# Altium schematic sheet Peripheral.SchDoc
size 381 x 215 mm; SheetNumber: 2; SheetTotal: 2
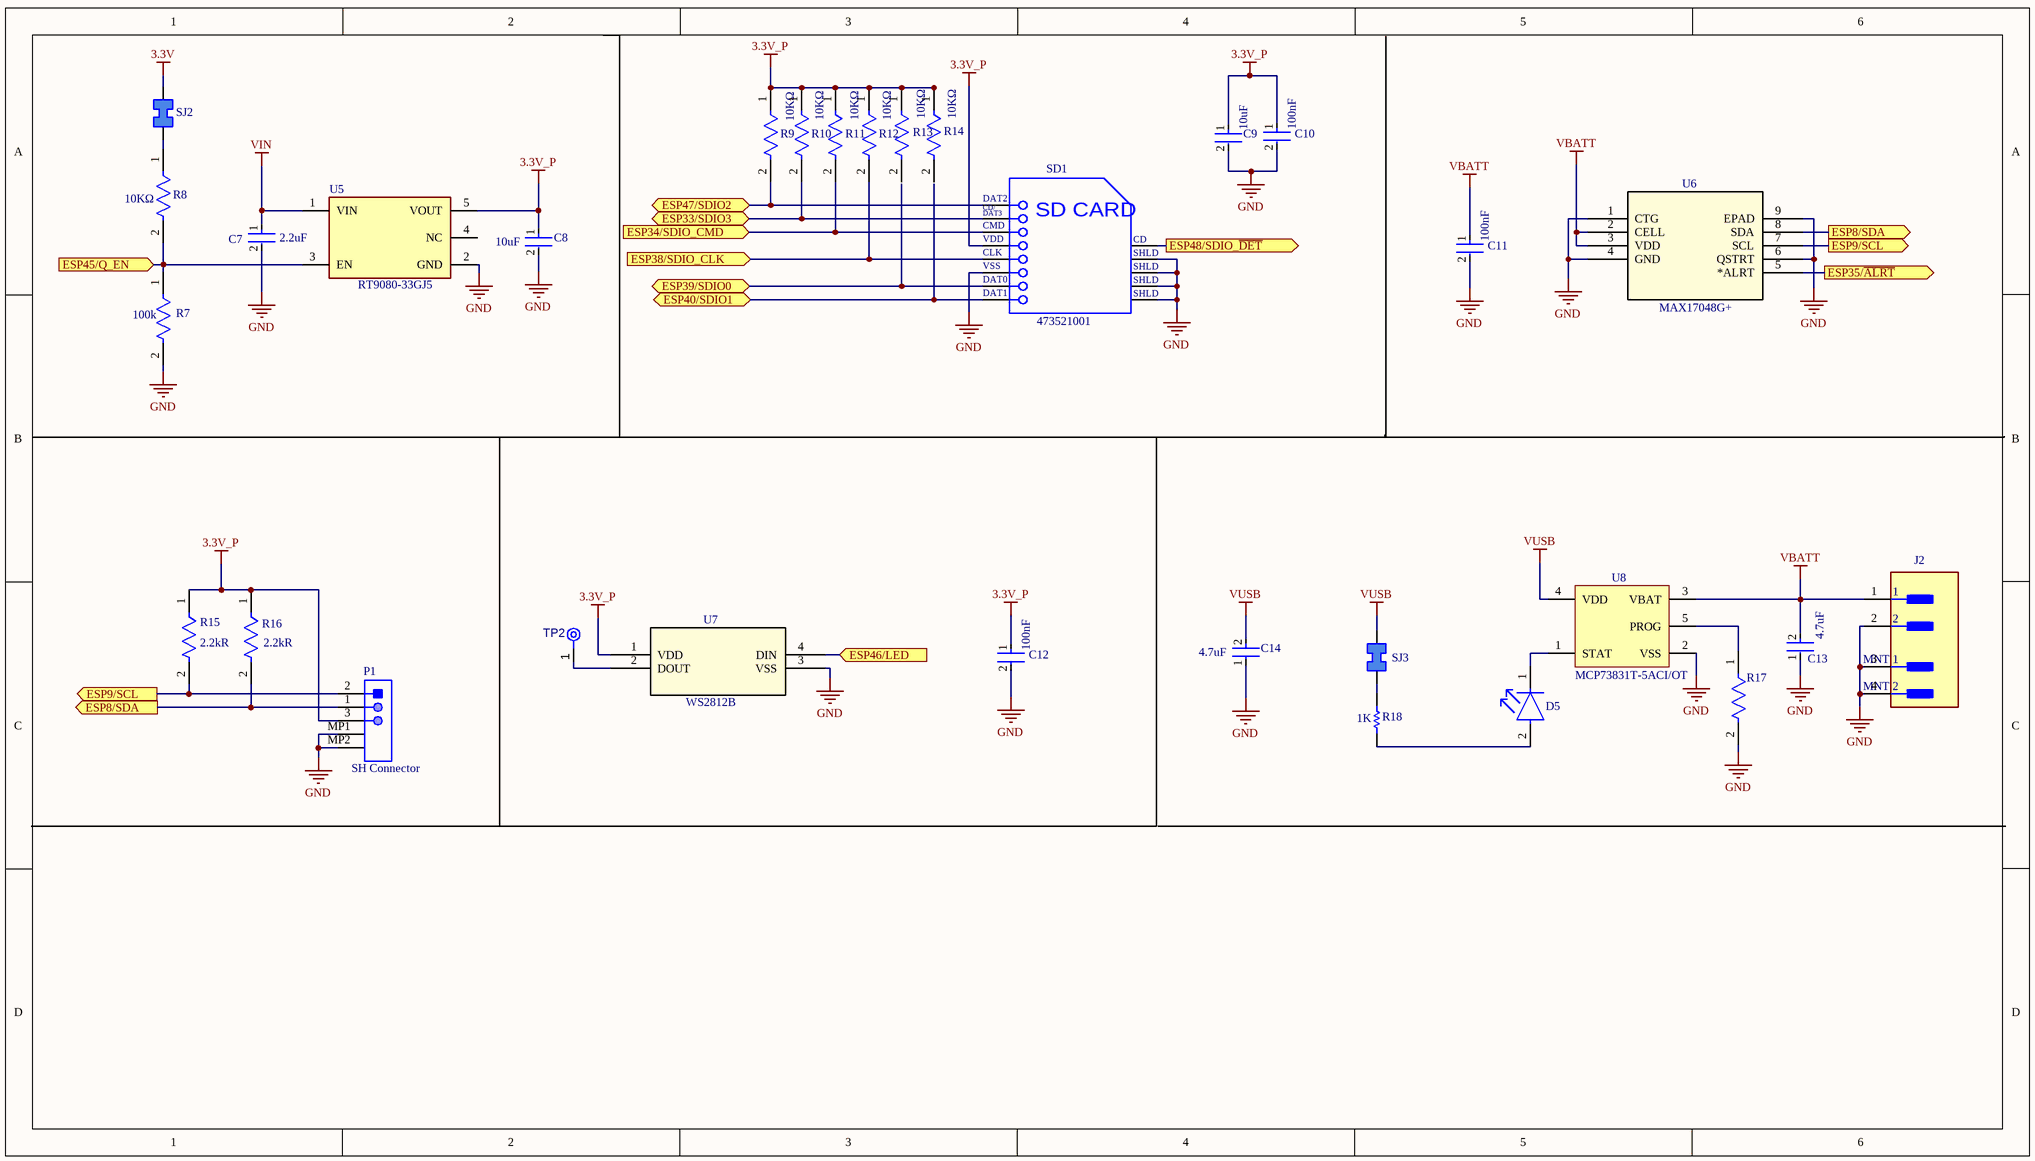
[diagram p0: Peripheral.SchDoc]

## Parts
C7  Capacitance: 2.2uF  [FP-GRM155-0_1-IPC_C]  (hidden comment: GRM155C81A225KE44D)
C8  Capacitance: 10uF  [FP-CL21-IPC_C]  (hidden comment: CL21A106MQFNNNE)
C9  Capacitance: 10uF  [FP-CL21-IPC_C]  (hidden comment: CL21A106MQFNNNE)
C10  Capacitance: 100nF  [FP-GRM033-0_03-IPC_B]  (hidden comment: GRM033C70J104KE14D)
C11  Capacitance: 100nF  [FP-GRM033-0_03-IPC_B]  (hidden comment: GRM033C70J104KE14D)
C12  Capacitance: 100nF  [FP-GRM033-0_03-IPC_B]  (hidden comment: GRM033C70J104KE14D)
C13  Capacitance: 4.7uF  [FP-0402-L_1_0_0_15-W_0_5-IPC_C]  (hidden comment: JMK105BC6475MV-F)
C14  Capacitance: 4.7uF  [FP-GRM219-0_15-0_1-IPC_C]  (hidden comment: GRM219R6YA475MA73D)
D5  LTST-C191KSKT  [FP-LTST-C191KSKT-MFG]  (value not drawn)
J2  SM02B-SRSS-TB (LF)(SN)  [FP-SM02B-SRSS-TB_LF_SN-MFG]  (value not drawn)
P1  SH Connector  [JST-SM03B-SRSS-TB_V]
R7  Resistance: 100k  [FP-CRCW0402-C-e3-MFG]  (hidden comment: CRCW0402100KFKEDC)
R8  value 10KΩ  [FP-RT0201-MFG]  (hidden comment: RT0201FRE0710KL)
R9  value 10KΩ  [FP-RT0201-MFG]  (hidden comment: RT0201FRE0710KL)
R10  value 10KΩ  [FP-RT0201-MFG]  (hidden comment: RT0201FRE0710KL)
R11  value 10KΩ  [FP-RT0201-MFG]  (hidden comment: RT0201FRE0710KL)
R12  value 10KΩ  [FP-RT0201-MFG]  (hidden comment: RT0201FRE0710KL)
R13  value 10KΩ  [FP-RT0201-MFG]  (hidden comment: RT0201FRE0710KL)
R14  value 10KΩ  [FP-RT0201-MFG]  (hidden comment: RT0201FRE0710KL)
R15  Resistance: 2.2kR  [FP-CRCW0402-e3-IPC_B]  (hidden comment: CRCW04022K20FKEDC)
R16  Resistance: 2.2kR  [FP-CRCW0402-e3-IPC_B]  (hidden comment: CRCW04022K20FKEDC)
R17  CR0402AFX-2001GLF  [FP-CR0402A-IPC_A]  (value not drawn)
R18  Resistance: 1K  [RESC1005X40X25ML10T10]  (hidden comment: 1-1622826-8)
SD1  473521001  [MOLX-473521001_V]
SJ2  Solder Jumper  [Solder Jumper-Footprint-1]  (value not drawn)
SJ3  Solder Jumper  [Solder Jumper-Footprint-1]  (value not drawn)
TP2  TPAD6R  [TP06R]  (value not drawn)  (no BOM)
U5  RT9080-33GJ5  [FP-RT9080-33GJ5-IPC_C]
U6  MAX17048G+  [21-0168_T822+3_MXM]
U7  WS2812B  [WS2812B_WDS]
U8  MCP73831T-5ACI/OT  [SOT-23-OT5_N]

## Ports
ESP8/SDA (out, see Esp32_USB[3B], Esp32_USB[6C], Peripheral[1C]), ESP8/SDA (out, see Esp32_USB[3B], Esp32_USB[6C], Peripheral[6A]), ESP9/SCL (out, see Esp32_USB[3B], Esp32_USB[6C], Peripheral[1C]), ESP9/SCL (out, see Esp32_USB[3B], Esp32_USB[6C], Peripheral[6A]), ESP33/SDIO3 (bidir, see Esp32_USB[4A]), ESP34/SDIO_CMD (in, see Esp32_USB[4A]), ESP35/~{ALRT} (out, see Esp32_USB[4A]), ESP38/SDIO_CLK (in, see Esp32_USB[4B]), ESP39/SDIO0 (bidir, see Esp32_USB[4B]), ESP40/SDIO1 (bidir, see Esp32_USB[4B]), ESP45/Q_EN (in, see Esp32_USB[4B]), ESP46/LED (in, see Esp32_USB[4B]), ESP47/SDIO2 (bidir, see Esp32_USB[4B]), ESP48/SDIO_~{DET} (out, see Esp32_USB[4B])

## Nets
3.3V: SJ2.1
3.3V_P: C8.1 C9.1 C10.1 C12.1 P1.3 R9.1 R10.1 R11.1 R12.1 R13.1 R14.1 R15.1 R16.1 SD1.4(VDD) U5.5(VOUT) U7.1(VDD)
GND: C7.2 C8.2 C9.2 C10.2 C11.2 C12.2 C13.1 C14.1 J2.2 J2.3(MNT_1) J2.4(MNT_2) P1.MP1 P1.MP2 R7.2 R17.2 SD1.6(VSS) SD1.10(SHLD) SD1.11(SHLD) SD1.12(SHLD) SD1.13(SHLD) U5.2(GND) U6.1(CTG) U6.4(GND) U6.6(QSTRT) U6.9(EPAD) U7.3(VSS) U8.2(VSS)
VBATT: C11.1 C13.2 J2.1 U6.2(CELL) U6.3(VDD) U8.3(VBAT)
VIN: C7.1 U5.1(VIN)
VUSB: C14.2 SJ3.1 U8.4(VDD)
ESP8/SDA: P1.1 R16.2 U6.8(SDA) ; port ESP8/SDA
ESP9/SCL: P1.2 R15.2 U6.7(SCL) ; port ESP9/SCL
ESP33/SDIO3: R10.2 SD1.2(CD/DAT3) ; port ESP33/SDIO3
ESP34/SDIO_CMD: R11.2 SD1.3(CMD) ; port ESP34/SDIO_CMD
ESP35/~{ALRT}: U6.5(*ALRT) ; port ESP35/~{ALRT}
ESP38/SDIO_CLK: R12.2 SD1.5(CLK) ; port ESP38/SDIO_CLK
ESP39/SDIO0: SD1.7(DAT0) ; port ESP39/SDIO0
ESP40/SDIO1: SD1.8(DAT1) ; port ESP40/SDIO1
ESP45/Q_EN: R7.1 R8.2 U5.3(EN) ; port ESP45/Q_EN
ESP46/LED: U7.4(DIN) ; port ESP46/LED
ESP47/SDIO2: R9.2 SD1.1(DAT2) ; port ESP47/SDIO2
ESP48/SDIO_~{DET}: SD1.9(CD) ; port ESP48/SDIO_~{DET}
NetD5_1: D5.1(C) U8.1(STAT)
NetD5_2: D5.2(A) R18.2
NetR8_1: R8.1 SJ2.2
NetR17_1: R17.1 U8.5(PROG)
NetR18_1: R18.1 SJ3.2
NetTP2_1: TP2.1(TP) U7.2(DOUT)

Not connected (* = marked no-connect by the designer): R13 2; R14 2; U5 4(NC)

## Notes on the sheet
- (in symbol CMP-2000-05848-1) CD/; DAT3; SD CARD

## Library data of the parts
C7 = CMP-06035-004415-1: Chip Multilayer Ceramic Capacitors for General Purpose, 0402, 2.2uF, X6S, 22%, 10%, 10V; Max Operating Temperature: 105°C; Case Code (Imperial): 0402; Mount: Surface Mount; Case/Package: 0402; Termination: SMD/SMT; Voltage Rating: 10V; Tolerance: 10%; Thickness: 0.022inch; Length: 0.039inch; Packaging: Tape and Reel; Weight: 0.000212oz; Width: 0.02inch; Dielectric: X6S; Package Quantity: 10000; Min Operating Temperature: -55°C; Height: 0.5mm; Case Code (Metric): 1005; Voltage Rating (DC): 10V
C8 C9 = CMP-13271-000780-1: CL21 Series 0805 10uF 6.3V ±20% Tolerance X5R Multilayer Ceramic Chip Capacitor; Thickness: 0.053inch; Voltage Rating: 6.3V; Case Code (Metric): 2012; Width: 0.049inch; Radiation Hardening: No; Height: 1.25mm; Voltage Rating (DC): 6.3V; Depth: 1.25mm; Tolerance: 20%; Lead Free: Lead Free; Case Code (Imperial): 0805; Max Operating Temperature: 85°C; Length: 2mm; Packaging: Tape and Reel; Mount: Surface Mount; Dielectric: X5R; Case/Package: 0805; Min Operating Temperature: -55°C
C10-C12 = CMP-06035-000516-1: Chip Multilayer Ceramic Capacitors for General Purpose, 0201, 0.10uF, X7S, 22%, 10%, 6.3V; Dielectric: X7S; Thickness: 300um; Length: 600um; Voltage Rating (DC): 6.3V; Width: 300um; Tolerance: 10%
C13 = CMP-14477-001053-2: None; Voltage Rating: 6.3V; Tolerance: 20%; Case/Package: 0402; Packaging: Tape and Reel; Min Operating Temperature: -55°C; Max Operating Temperature: 105°C; Case Code (Metric): 1005; RoHS Compliant: Yes; Lead Free: Lead Free; Mount: Surface Mount; Case Code (Imperial): 0402
C14 = CMP-2007-00095-2: Chip Multilayer Ceramic Capacitors for General Purpose, 0805, 4.7uF, X5R, 15%, 20%, 35V; Case Code (Metric): 2012; Case Code (Imperial): 0805; Voltage Rating (DC): 35V; Case/Package: 0805; Voltage Rating: 35V; Depth: 1.25mm; Thickness: 0.037inch; Height: 0.85mm; Lead Free: Lead Free; Package Quantity: 4000; Length: 2mm; Width: 1.25mm; Mount: Surface Mount; Voltage: 35V; Packaging: Tape and Reel; Min Operating Temperature: -55°C; Termination: SMD/SMT; Tolerance: 20%; Dielectric: X5R; REACH SVHC: No SVHC; Max Operating Temperature: 85°C
D5 = CMP-22017-000025-1: LED YELLOW CLEAR SMD; Dominant Wavelength: 597nm; Power Rating: 75mW; Number of LEDs: 1; Lens Style: Diffused; Forward Current: 30mA; Test Current: 20mA; Forward Voltage: 2.4V; Wavelength: 588nm; Viewing Angle: 130°; Lens Color: Colorless; Reverse Voltage: 5V; Luminous Intensity: 180mcd; Case Code (Imperial): 0603; Width: 0.8mm; Power Dissipation: 75mW; Length: 1.6mm; Illumination Color: Yellow; Number of Pins: 2; Case Code (Metric): 1608; Mount: Surface Mount; Number of Elements: 1; Height: 0.55mm; Lens Transparency: Clear; Depth: 0.8mm; Min Operating Temperature: -55°C; Case/Package: 0603; Radiation Hardening: No; Max Operating Temperature: 85°C; Package Quantity: 1; Packaging: Tape and Reel; Lead Free: Lead Free; Color: Yellow
J2 = CMP-17439-000368-1: CONN HEADER SMD R/A 2POS 1MM; Max Current Rating: 1A; Voltage Rating (AC): 50V; Current Rating: 700mA; Contact Resistance: 40mR; Number of Positions: 2; Insulation Resistance: 100MR; Fastening Type: Pull; Orientation: Right Angle; Insulation Color: Natural; Insulation Material: Nylon; Connector Type: Header; Contact Type: Male Pin; Number of Rows: 1; Housing Material: Polyamide; Contact Material: Copper Alloy; Mount: Surface Mount; Packaging: Tape and Reel; Lead Pitch: 1mm; REACH SVHC: No SVHC; Flammability Rating: UL94 V-0; Termination: Solder; Series: SR; Length: 4mm; Color: Natural; Min Operating Temperature: -25°C; Pitch: 1mm; Depth: 4.95mm; Contact Plating: Tin; Lead Free: Lead Free; Max Operating Temperature: 85°C; Contact Finish - Mating: TIN; Material: Polyamide; Voltage Rating: 50V; Max Voltage Rating (AC): 50V; Housing Color: Beige; Contact Shape: Square; Number of Contacts: 2
P1 = CMP-2000-07077-1: Male Header, Pitch 1 mm, 1 x 3 Position, Height 2.9 mm, -25 to 85 degC, RoHS, Tape and Reel; Manufacturer: JST; Pitch: 1mm; Style/Orientation: RightAngleHeader/Plug; No of Positions: 3; Package Description: Male Header, Pitch 1 mm, 1 x 3 Position, Height 2.9 mm; Manufacturer URL: http://www.jst.com/home2.html; Package Reference: SM03B-SRSS-TB; Type: ShroudedHeader; Termination: Crimp; Mounting Technology: SurfaceMount; Datasheet Version: 11/2010; Datasheet URL: https://datasheet.ciiva.com/26894/getdatasheetpartid-708885-26894671.pdf
R7 = CMP-02407-010951-1: RES 100K OHM 1% 1/16W 0402; Temperature Coefficient: 100ppm/°C; Power Rating: 62.5mW; Lead Free: Lead Free; Length: 1mm; Tolerance: 1%; Resistor Type: Thick Film; Contact Plating: Tin; Case/Package: SMD/SMT; Min Operating Temperature: -55°C; RoHS Compliant: Yes; Termination: Wraparound; Max Operating Temperature: 155°C; Mount: Surface Mount
R8-R14 = CMP-03412-013100-1: RES SMD 10K OHM 1% 1/20W 0201; Manufacturer: Yageo; Temperature Coefficient: 50 ppm/°C; Voltage Rating: 25V; Power Rating: 0.05W; Tolerance: 0.01; Digikey Description: RES SMD 10K OHM 1% 1/20W 0201; Resistance: 10KΩ; ComponentLink2Description: Datasheet; Series: RT; Composition: Thin Film; Ipc Land Pattern Name: RESC6030X23; Device Class L3: Chip SMD Resistors; Device Class L1: Passive Components; RoHS: TRUE; Category: Res; Manufacturer Part Number: RT0201FRE0710KL; ComponentLink2URL: http://www.yageo.com/documents/recent/PYu-RT_1-to-0.01_RoHS_L_9.pdf; Automotive: No; Temperature: -55°C to +125°C; Temperature Range Low: -55°C; Height: 0.26mm; Package: RT0201; Device Class L2: Resistors; Temperature Range High: +125°C; Octopart: https://octopart.com/rt0201fre0710kl-yageo-71392129; Footprint Url: http://www.yageo.com/exep/pages/download/literatures/PYu-R_Mount_10.pdf; Mouser Description: Res Thin Film 0201 10K Ohm 1% 1/20W ±50ppm/°C Molded SMD Paper T/R; Lead Free: Yes
R15 R16 = CMP-02407-013149-1: RES 2.2K OHM 1% 1/16W 0402; Max Power Dissipation: 63mW; Power Rating: 62.5mW; Temperature Coefficient: 100ppm/°C; RoHS Compliant: Yes; Tolerance: 1%; Case/Package: 0402; Max Operating Temperature: 155°C; Mount: Surface Mount; Case Code (Imperial): 0402; Contact Plating: Tin; Lead Free: Lead Free; Number of Terminations: 2; Min Operating Temperature: -55°C; Case Code (Metric): 1005; Resistor Type: Thick Film; Series: CRCW-C; Packaging: Cut Tape; Termination: Wraparound; Length: 1mm
R17 = CMP-07231-001734-1: AEC-Q200 Compliant Chip Resistors 0402 2kΩ 0.063W 1% 100ppm/°C
R18 = CMP-2002-04643-1: Manufacturer: TE Connectivity / AMP; Part Number: 1-1622826-8
SD1 = CMP-2000-05848-1: MicroSD(TM), Pitch 1.1 mm, 8 Position, Height 1.88 mm, -20 to 85 degC, RoHS, Tape and Reel; Manufacturer: Molex; Datasheet Version: Rev. G, 01/2012; Datasheet URL: http://www.molex.com/pdm_docs/sd/473521001_sd.pdf; Package Reference: 473521001; Manufacturer URL: http://www.molex.com/; Mounting Technology: SurfaceMount; Package Description: MicroSD(TM), Pitch 1.1 mm, 8 Position, Height 1.88 mm; Supplier: Arrow Electronics; Supplier Part Number: 0473521001
SJ2 SJ3 = CMP-00030-00001-3: 2 pad Solder Jumper; Mounting Technology: Surface Mount; Min Operating Temperature: -55°C; Pins: 2; Max Operating Temperature: 155°C; Case/Package: 1206
TP2 = CMP-00028-00002-2: 0.6mm round; Pins: 1
U5 = CMP-79890-000003-1: IC REG LIN 3.3V 600MA TSOT23-5; Power Supply Rejection Ratio (PSRR): 75dB; Output Type: Fixed; Max Input Voltage: 5.5V; Dropout Voltage: 530mV; Output Configuration: Positive; Quiescent Current: 4uA; Number of Regulators: 1; Packaging: Cut Tape; RoHS Compliant: Yes; Mount: Surface Mount; Max Operating Temperature: 85°C; Min Output Voltage: 3.3V; Output Current: 600mA; Min Operating Temperature: -40°C; Case/Package: SOT-23-5
U6 = MAX17048G+: 3ÂµA 1-Cell/2-Cell Fuel Gauge with ModelGauge; Manufacturer_Name: Analog Devices Inc; Copyright: Copyright (C) 2025 Ultra Librarian. All rights reserved.; Manufacturer_Part_Number: MAX17048G+; RefDes: RefDes; Type: Type; Supplier 1: DigiKey; Supplier Part Number 1: MAX17048G+T10CT-ND
U7 = WS2812B: No Description Available; Manufacturer_Name: Worldsemi; Copyright: Copyright (C) 2025 Ultra Librarian. All rights reserved.; Manufacturer_Part_Number: WS2812B; RefDes: RefDes; Type: Type; Supplier 1: DigiKey; Supplier Part Number 1: 28085-ND
U8 = CMP-0133-00136-1: Miniature Single-Cell, Fully Integrated Li-Ion, Li-Polymer Charge Management Controller, 4.5V, 5-Pin SOT-23, Industrial Temperature, Tape and Reel; PackageReference: SOT-23-OT5; PackageDescription: 5-Lead Plastic Small Outline Transistor (OT) [SOT-23]; PackageVersion: revBB, Aug-2009; DatasheetVersion: revE, Sep-2008; Code_IPC: SOT23-5